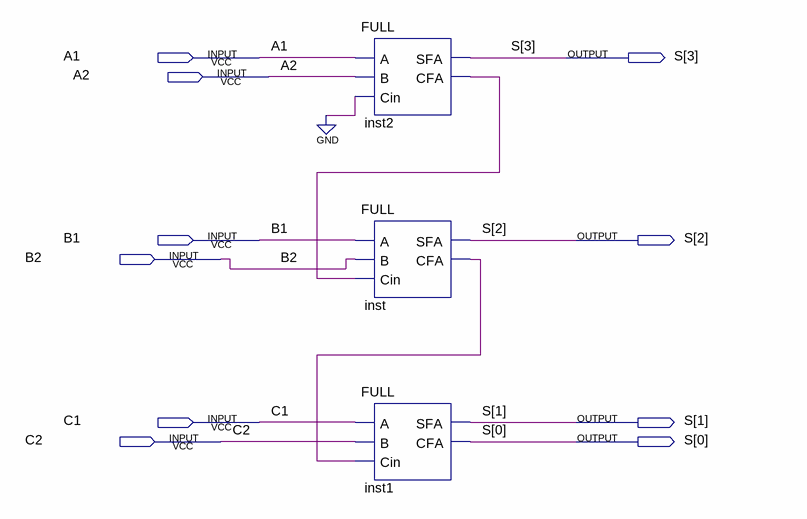
[diagram p0: schematic sheet]
// Quartus schematic RCATHREE.bdf as structural Verilog: 3 symbols, 10 pins
module RCATHREE (
  input  A1,
  input  A2,
  input  B1,
  input  B2,
  input  C1,
  input  C2,
  output [3:0] S
);

  wire inst2_cfa, inst_cfa;

  FULL inst2 (.A(A1), .B(A2), .Cin(1'b0), .SFA(S[3]), .CFA(inst2_cfa));
  FULL inst (.A(B1), .B(B2), .Cin(inst2_cfa), .SFA(S[2]), .CFA(inst_cfa));
  FULL inst1 (.A(C1), .B(C2), .Cin(inst_cfa), .SFA(S[1]), .CFA(S[0]));
endmodule
